# Altium schematic sheet DEV Board.SchDoc
size A
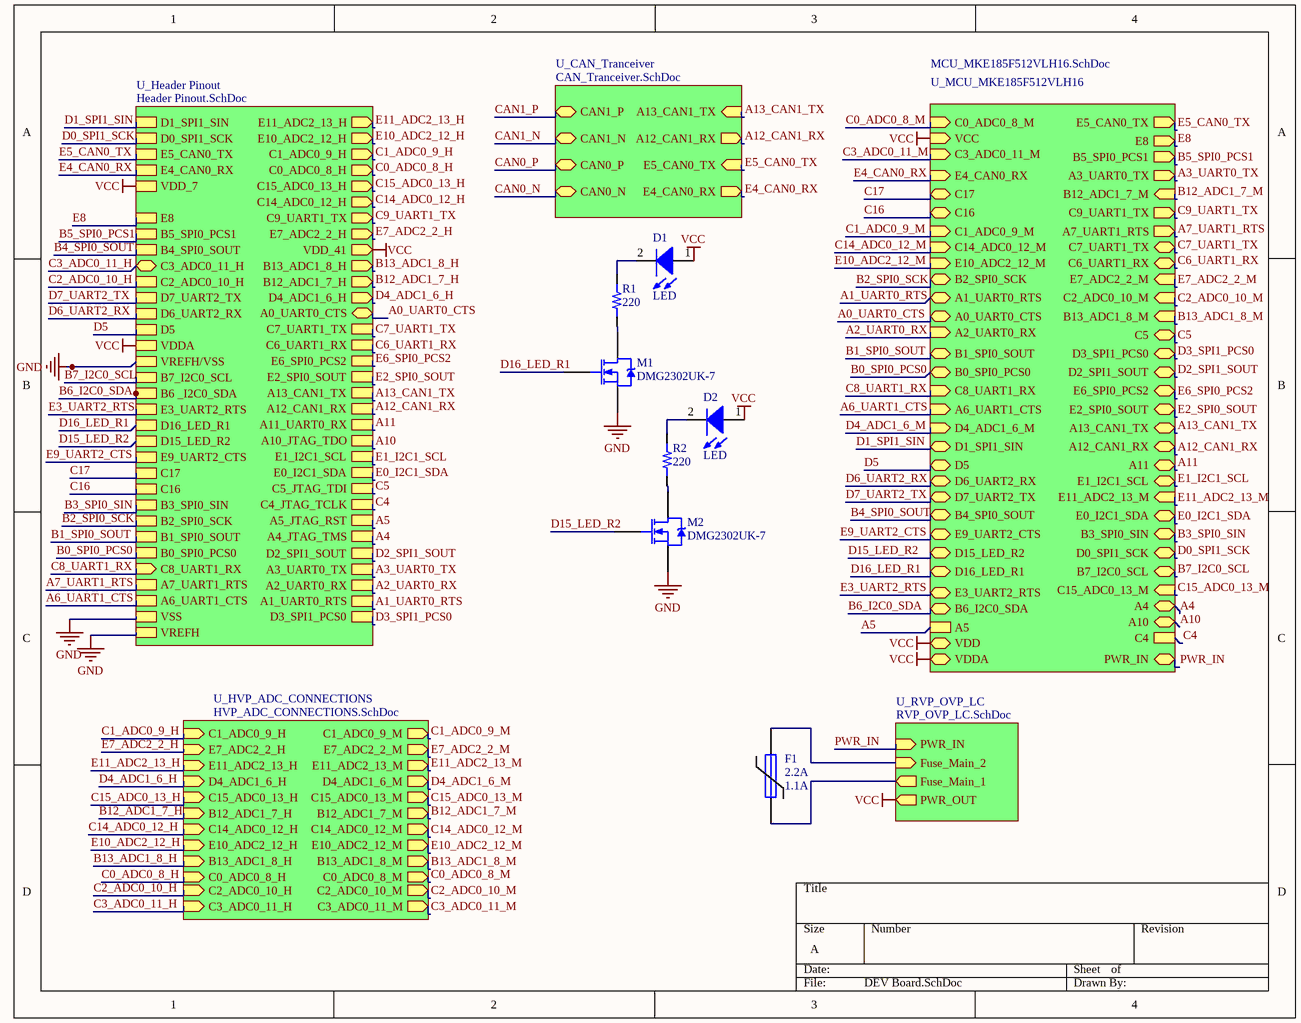
[diagram p0: DEV Board.SchDoc]

## Parts
D1  LED  [0805_LED]
D2  LED  [0805_LED]
F1  2.2A  I_hold: 1.1A  [PIN-W2/E2.8]
M1  DMG2302UK-7  [SOT23-3]
M2  DMG2302UK-7  [SOT23-3]
R1  value 220  [RES 0402/1005]  (hidden comment: Resistor 220 0402 1/10W 1%)
R2  value 220  [RES 0402/1005]  (hidden comment: Resistor 220 0402 1/10W 1%)

## Sub-sheets
U_CAN_Tranceiver = CAN_Tranceiver.SchDoc: A12_CAN1_RX (out), A13_CAN1_TX (in), CAN1_P (bidir), CAN1_N (bidir), E4_CAN0_RX (out), E5_CAN0_TX (in), CAN0_P (bidir), CAN0_N (bidir)
U_Header Pinout = Header Pinout.SchDoc: D1_SPI1_SIN, D0_SPI1_SCK, E11_ADC2_13_H (out), E10_ADC2_12_H (out), E5_CAN0_TX, E4_CAN0_RX, E8, B5_SPI0_PCS1, B4_SPI0_SOUT, D7_UART2_TX, D6_UART2_RX, D5, VDDA, B7_I2C0_SCL, E3_UART2_RTS, E9_UART2_CTS, C1_ADC0_9_H (out), C0_ADC0_8_H (out), C17, C16, C15_ADC0_13_H (out), C14_ADC0_12_H (out), B3_SPI0_SIN, B2_SPI0_SCK, B1_SPI0_SOUT, B0_SPI0_PCS0, C9_UART1_TX (out), C8_UART1_RX (in), A7_UART1_RTS, A6_UART1_CTS, E7_ADC2_2_H (out), VSS, B13_ADC1_8_H (out), B12_ADC1_7_H (out), D4_ADC1_6_H (out), D3_SPI1_PCS0, D2_SPI1_SOUT, A3_UART0_TX, A2_UART0_RX, A1_UART0_RTS, C7_UART1_TX, C6_UART1_RX, E6_SPI0_PCS2, E2_SPI0_SOUT, A13_CAN1_TX, A12_CAN1_RX, A11_UART0_RX, A10_JTAG_TDO, E1_I2C1_SCL, E0_I2C1_SDA, C5_JTAG_TDI, C4_JTAG_TCLK, A5_JTAG_RST, A4_JTAG_TMS, C3_ADC0_11_H (bidir), C2_ADC0_10_H, D16_LED_R1, D15_LED_R2, A0_UART0_CTS (bidir), B6 _I2C0_SDA, VREFH/VSS, VREFH, VDD_7, VDD_41 (out)
U_HVP_ADC_CONNECTIONS = HVP_ADC_CONNECTIONS.SchDoc: B13_ADC1_8_M (out), C15_ADC0_13_M (out), E10_ADC2_12_M (out), E7_ADC2_2_M (out), C14_ADC0_12_M (out), C0_ADC0_8_M (out), E11_ADC2_13_M (out), D4_ADC1_6_M (out), C1_ADC0_9_M (out), B12_ADC1_7_M (out), C1_ADC0_9_H (in), E7_ADC2_2_H (in), E11_ADC2_13_H (in), D4_ADC1_6_H (in), C15_ADC0_13_H (in), C14_ADC0_12_H (in), E10_ADC2_12_H (in), B13_ADC1_8_H (in), C0_ADC0_8_H (in), C2_ADC0_10_H (in), C3_ADC0_11_H (in), C3_ADC0_11_M (out), C2_ADC0_10_M (out), B12_ADC1_7_H (in)
U_MCU_MKE185F512VLH16 = MCU_MKE185F512VLH16.SchDoc: E5_CAN0_TX (out), E4_CAN0_RX (in), E8 (out), B5_SPI0_PCS1 (out), C17 (bidir), C16 (bidir), B3_SPI0_SIN (bidir), B2_SPI0_SCK (bidir), A1_UART0_RTS (bidir), A0_UART0_CTS (bidir), A3_UART0_TX (out), A2_UART0_RX (in), B1_SPI0_SOUT (bidir), B0_SPI0_PCS0 (bidir), C9_UART1_TX (out), C8_UART1_RX (in), A7_UART1_RTS (out), A6_UART1_CTS (in), D5 (bidir), D6_UART2_RX (bidir), D7_UART2_TX (bidir), B4_SPI0_SOUT (bidir), E9_UART2_CTS (bidir), E3_UART2_RTS (bidir), B6_I2C0_SDA (bidir), B7_I2C0_SCL (bidir), D0_SPI1_SCK (bidir), D1_SPI1_SIN (bidir), C7_UART1_TX (bidir), C6_UART1_RX (bidir), E6_SPI0_PCS2 (bidir), E2_SPI0_SOUT (bidir), A13_CAN1_TX (bidir), A12_CAN1_RX (bidir), A11 (bidir), E1_I2C1_SCL (bidir), E0_I2C1_SDA (bidir), D2_SPI1_SOUT (bidir), C5 (bidir), VCC (in), C2_ADC0_10_M (in), C3_ADC0_11_M (in), C1_ADC0_9_M (in), C0_ADC0_8_M (in), C14_ADC0_12_M (in), C15_ADC0_13_M (in), D4_ADC1_6_M (in), E10_ADC2_12_M (in), B12_ADC1_7_M (in), E7_ADC2_2_M (in), E11_ADC2_13_M (in), B13_ADC1_8_M (in), D15_LED_R2 (bidir), D16_LED_R1 (bidir), A4 (bidir), A10 (bidir), C4, A5, D3_SPI1_PCS0 (bidir), VDD (bidir), VDDA (bidir), PWR_IN (bidir)
U_RVP_OVP_LC = RVP_OVP_LC.SchDoc: PWR_IN (in), Fuse_Main_2 (in), Fuse_Main_1 (out), PWR_OUT (out)

## Nets
GND: M1.2(S) M2.2(S) ; sheet U_Header Pinout/VSS, sheet U_Header Pinout/VREFH/VSS, sheet U_Header Pinout/VREFH
VCC: D1.1(A) D2.1(A) ; sheet U_MCU_MKE185F512VLH16/VCC, sheet U_MCU_MKE185F512VLH16/VDD, sheet U_MCU_MKE185F512VLH16/VDDA, sheet U_RVP_OVP_LC/PWR_OUT, sheet U_Header Pinout/VDDA, sheet U_Header Pinout/VDD_7, sheet U_Header Pinout/VDD_41
A0_UART0_CTS: sheet U_MCU_MKE185F512VLH16/A0_UART0_CTS, sheet U_Header Pinout/A0_UART0_CTS
A1_UART0_RTS: sheet U_MCU_MKE185F512VLH16/A1_UART0_RTS, sheet U_Header Pinout/A1_UART0_RTS
A2_UART0_RX: sheet U_MCU_MKE185F512VLH16/A2_UART0_RX, sheet U_Header Pinout/A2_UART0_RX
A3_UART0_TX: sheet U_MCU_MKE185F512VLH16/A3_UART0_TX, sheet U_Header Pinout/A3_UART0_TX
A4: sheet U_MCU_MKE185F512VLH16/A4, sheet U_Header Pinout/A4_JTAG_TMS
A5: sheet U_MCU_MKE185F512VLH16/A5, sheet U_Header Pinout/A5_JTAG_RST
A6_UART1_CTS: sheet U_MCU_MKE185F512VLH16/A6_UART1_CTS, sheet U_Header Pinout/A6_UART1_CTS
A7_UART1_RTS: sheet U_MCU_MKE185F512VLH16/A7_UART1_RTS, sheet U_Header Pinout/A7_UART1_RTS
A10: sheet U_MCU_MKE185F512VLH16/A10, sheet U_Header Pinout/A10_JTAG_TDO
A11: sheet U_MCU_MKE185F512VLH16/A11, sheet U_Header Pinout/A11_UART0_RX
A12_CAN1_RX: sheet U_MCU_MKE185F512VLH16/A12_CAN1_RX, sheet U_CAN_Tranceiver/A12_CAN1_RX, sheet U_Header Pinout/A12_CAN1_RX
A13_CAN1_TX: sheet U_MCU_MKE185F512VLH16/A13_CAN1_TX, sheet U_CAN_Tranceiver/A13_CAN1_TX, sheet U_Header Pinout/A13_CAN1_TX
B0_SPI0_PCS0: sheet U_MCU_MKE185F512VLH16/B0_SPI0_PCS0, sheet U_Header Pinout/B0_SPI0_PCS0
B1_SPI0_SOUT: sheet U_MCU_MKE185F512VLH16/B1_SPI0_SOUT, sheet U_Header Pinout/B1_SPI0_SOUT
B2_SPI0_SCK: sheet U_MCU_MKE185F512VLH16/B2_SPI0_SCK, sheet U_Header Pinout/B2_SPI0_SCK
B3_SPI0_SIN: sheet U_MCU_MKE185F512VLH16/B3_SPI0_SIN, sheet U_Header Pinout/B3_SPI0_SIN
B4_SPI0_SOUT: sheet U_MCU_MKE185F512VLH16/B4_SPI0_SOUT, sheet U_Header Pinout/B4_SPI0_SOUT
B5_SPI0_PCS1: sheet U_MCU_MKE185F512VLH16/B5_SPI0_PCS1, sheet U_Header Pinout/B5_SPI0_PCS1
B6_I2C0_SDA: sheet U_MCU_MKE185F512VLH16/B6_I2C0_SDA, sheet U_Header Pinout/B6 _I2C0_SDA
B7_I2C0_SCL: sheet U_MCU_MKE185F512VLH16/B7_I2C0_SCL, sheet U_Header Pinout/B7_I2C0_SCL
B12_ADC1_7_H: sheet U_HVP_ADC_CONNECTIONS/B12_ADC1_7_H, sheet U_Header Pinout/B12_ADC1_7_H
B12_ADC1_7_M: sheet U_MCU_MKE185F512VLH16/B12_ADC1_7_M, sheet U_HVP_ADC_CONNECTIONS/B12_ADC1_7_M
B13_ADC1_8_H: sheet U_HVP_ADC_CONNECTIONS/B13_ADC1_8_H, sheet U_Header Pinout/B13_ADC1_8_H
B13_ADC1_8_M: sheet U_MCU_MKE185F512VLH16/B13_ADC1_8_M, sheet U_HVP_ADC_CONNECTIONS/B13_ADC1_8_M
C0_ADC0_8_H: sheet U_HVP_ADC_CONNECTIONS/C0_ADC0_8_H, sheet U_Header Pinout/C0_ADC0_8_H
C0_ADC0_8_M: sheet U_MCU_MKE185F512VLH16/C0_ADC0_8_M, sheet U_HVP_ADC_CONNECTIONS/C0_ADC0_8_M
C1_ADC0_9_H: sheet U_HVP_ADC_CONNECTIONS/C1_ADC0_9_H, sheet U_Header Pinout/C1_ADC0_9_H
C1_ADC0_9_M: sheet U_MCU_MKE185F512VLH16/C1_ADC0_9_M, sheet U_HVP_ADC_CONNECTIONS/C1_ADC0_9_M
C2_ADC0_10_H: sheet U_HVP_ADC_CONNECTIONS/C2_ADC0_10_H, sheet U_Header Pinout/C2_ADC0_10_H
C2_ADC0_10_M: sheet U_MCU_MKE185F512VLH16/C2_ADC0_10_M, sheet U_HVP_ADC_CONNECTIONS/C2_ADC0_10_M
C3_ADC0_11_H: sheet U_HVP_ADC_CONNECTIONS/C3_ADC0_11_H, sheet U_Header Pinout/C3_ADC0_11_H
C3_ADC0_11_M: sheet U_MCU_MKE185F512VLH16/C3_ADC0_11_M, sheet U_HVP_ADC_CONNECTIONS/C3_ADC0_11_M
C4: sheet U_MCU_MKE185F512VLH16/C4, sheet U_Header Pinout/C4_JTAG_TCLK
C5: sheet U_MCU_MKE185F512VLH16/C5, sheet U_Header Pinout/C5_JTAG_TDI
C6_UART1_RX: sheet U_MCU_MKE185F512VLH16/C6_UART1_RX, sheet U_Header Pinout/C6_UART1_RX
C7_UART1_TX: sheet U_MCU_MKE185F512VLH16/C7_UART1_TX, sheet U_Header Pinout/C7_UART1_TX
C8_UART1_RX: sheet U_MCU_MKE185F512VLH16/C8_UART1_RX, sheet U_Header Pinout/C8_UART1_RX
C9_UART1_TX: sheet U_MCU_MKE185F512VLH16/C9_UART1_TX, sheet U_Header Pinout/C9_UART1_TX
C14_ADC0_12_H: sheet U_HVP_ADC_CONNECTIONS/C14_ADC0_12_H, sheet U_Header Pinout/C14_ADC0_12_H
C14_ADC0_12_M: sheet U_MCU_MKE185F512VLH16/C14_ADC0_12_M, sheet U_HVP_ADC_CONNECTIONS/C14_ADC0_12_M
C15_ADC0_13_H: sheet U_HVP_ADC_CONNECTIONS/C15_ADC0_13_H, sheet U_Header Pinout/C15_ADC0_13_H
C15_ADC0_13_M: sheet U_MCU_MKE185F512VLH16/C15_ADC0_13_M, sheet U_HVP_ADC_CONNECTIONS/C15_ADC0_13_M
C16: sheet U_MCU_MKE185F512VLH16/C16, sheet U_Header Pinout/C16
C17: sheet U_MCU_MKE185F512VLH16/C17, sheet U_Header Pinout/C17
CAN0_N: sheet U_CAN_Tranceiver/CAN0_N
CAN0_P: sheet U_CAN_Tranceiver/CAN0_P
CAN1_N: sheet U_CAN_Tranceiver/CAN1_N
CAN1_P: sheet U_CAN_Tranceiver/CAN1_P
D0_SPI1_SCK: sheet U_MCU_MKE185F512VLH16/D0_SPI1_SCK, sheet U_Header Pinout/D0_SPI1_SCK
D1_SPI1_SIN: sheet U_MCU_MKE185F512VLH16/D1_SPI1_SIN, sheet U_Header Pinout/D1_SPI1_SIN
D2_SPI1_SOUT: sheet U_MCU_MKE185F512VLH16/D2_SPI1_SOUT, sheet U_Header Pinout/D2_SPI1_SOUT
D3_SPI1_PCS0: sheet U_MCU_MKE185F512VLH16/D3_SPI1_PCS0, sheet U_Header Pinout/D3_SPI1_PCS0
D4_ADC1_6_H: sheet U_HVP_ADC_CONNECTIONS/D4_ADC1_6_H, sheet U_Header Pinout/D4_ADC1_6_H
D4_ADC1_6_M: sheet U_MCU_MKE185F512VLH16/D4_ADC1_6_M, sheet U_HVP_ADC_CONNECTIONS/D4_ADC1_6_M
D5: sheet U_MCU_MKE185F512VLH16/D5, sheet U_Header Pinout/D5
D6_UART2_RX: sheet U_MCU_MKE185F512VLH16/D6_UART2_RX, sheet U_Header Pinout/D6_UART2_RX
D7_UART2_TX: sheet U_MCU_MKE185F512VLH16/D7_UART2_TX, sheet U_Header Pinout/D7_UART2_TX
D15_LED_R2: M2.1(G) ; sheet U_MCU_MKE185F512VLH16/D15_LED_R2, sheet U_Header Pinout/D15_LED_R2
D16_LED_R1: M1.1(G) ; sheet U_MCU_MKE185F512VLH16/D16_LED_R1, sheet U_Header Pinout/D16_LED_R1
E0_I2C1_SDA: sheet U_MCU_MKE185F512VLH16/E0_I2C1_SDA, sheet U_Header Pinout/E0_I2C1_SDA
E1_I2C1_SCL: sheet U_MCU_MKE185F512VLH16/E1_I2C1_SCL, sheet U_Header Pinout/E1_I2C1_SCL
E2_SPI0_SOUT: sheet U_MCU_MKE185F512VLH16/E2_SPI0_SOUT, sheet U_Header Pinout/E2_SPI0_SOUT
E3_UART2_RTS: sheet U_MCU_MKE185F512VLH16/E3_UART2_RTS, sheet U_Header Pinout/E3_UART2_RTS
E4_CAN0_RX: sheet U_MCU_MKE185F512VLH16/E4_CAN0_RX, sheet U_CAN_Tranceiver/E4_CAN0_RX, sheet U_Header Pinout/E4_CAN0_RX
E5_CAN0_TX: sheet U_MCU_MKE185F512VLH16/E5_CAN0_TX, sheet U_CAN_Tranceiver/E5_CAN0_TX, sheet U_Header Pinout/E5_CAN0_TX
E6_SPI0_PCS2: sheet U_MCU_MKE185F512VLH16/E6_SPI0_PCS2, sheet U_Header Pinout/E6_SPI0_PCS2
E7_ADC2_2_H: sheet U_HVP_ADC_CONNECTIONS/E7_ADC2_2_H, sheet U_Header Pinout/E7_ADC2_2_H
E7_ADC2_2_M: sheet U_MCU_MKE185F512VLH16/E7_ADC2_2_M, sheet U_HVP_ADC_CONNECTIONS/E7_ADC2_2_M
E8: sheet U_MCU_MKE185F512VLH16/E8, sheet U_Header Pinout/E8
E9_UART2_CTS: sheet U_MCU_MKE185F512VLH16/E9_UART2_CTS, sheet U_Header Pinout/E9_UART2_CTS
E10_ADC2_12_H: sheet U_HVP_ADC_CONNECTIONS/E10_ADC2_12_H, sheet U_Header Pinout/E10_ADC2_12_H
E10_ADC2_12_M: sheet U_MCU_MKE185F512VLH16/E10_ADC2_12_M, sheet U_HVP_ADC_CONNECTIONS/E10_ADC2_12_M
E11_ADC2_13_H: sheet U_HVP_ADC_CONNECTIONS/E11_ADC2_13_H, sheet U_Header Pinout/E11_ADC2_13_H
E11_ADC2_13_M: sheet U_MCU_MKE185F512VLH16/E11_ADC2_13_M, sheet U_HVP_ADC_CONNECTIONS/E11_ADC2_13_M
PWR_IN: sheet U_MCU_MKE185F512VLH16/PWR_IN, sheet U_RVP_OVP_LC/PWR_IN
NetD1_2: D1.2(K) R1.2
NetD2_2: D2.2(K) R2.2
NetF1_1: F1.1 ; sheet U_RVP_OVP_LC/Fuse_Main_1
NetF1_2: F1.2 ; sheet U_RVP_OVP_LC/Fuse_Main_2
NetM1_3: M1.3(D) R1.1
NetM2_3: M2.3(D) R2.1

## Library data of the parts
D1 D2 = 1: idLED: 1; Name: LED_0805_RED; Value: Red; Vf: 0.7V; Manufacturer_id: 1; Drawer_id: 1; Package: 0805
F1 = 8: Fuse; Manufacturer_id: 1; MfrPartNo: 1206L110/12SLYR; idFuse: 8; Name: Resettable; I_max: 50A; V_max: 12V; Pd_Typ: .8W; Published: 8-Jun-2000; LatestRevisionDate: 17-Jul-2002; LatestRevisionNote: Re-released for DXP Platform.; PackageReference: PIN-W2/E2.8; Publisher: Altium Limited; PackageDescription: Thru-Hole; 2 Leads; Drawer_id: 1; I_trip: 2.2A; Link: https://www.digikey.com/product-detail/en/littelfuse-inc/1206L110-12SLYR/F5764CT-ND/3593809
M1 M2 = 6: MOSFET N-CHANNEL 30V 5A SOT23; Manufacturer_id: 1; idFETs: 6; Value: N_Channel; Vdss: 20V; Id: 2.8A; Rds_On: 90mOhm; Vgs(typ): 800mV; Vgs(Max): 1V; Created_By: Angel; MfrPartNo: DMG2302UK-7; Drawer_id: 1; Name: DMG2302UK-7; Num_Circuits: 1; Package: SOT-23; Link: https://www.digikey.com/product-detail/en/diodes-incorporated/DMG2302UK-7/DMG2302UK-7DICT-ND/6010163; Supplier1: Digi-Key
R1 R2 = 57: Manufacturer_id: 1; idResistor: 57; Name: Res_220_0402_1/10W_1%; Created_By: Nick Mah; Supplier 1: Digi-Key; Drawer_id: 1; Tolerance: 1%; Power: 1/10W; Package: 0402; ComponentLink1Description: Datasheet; Created_Date: 2018-10-20